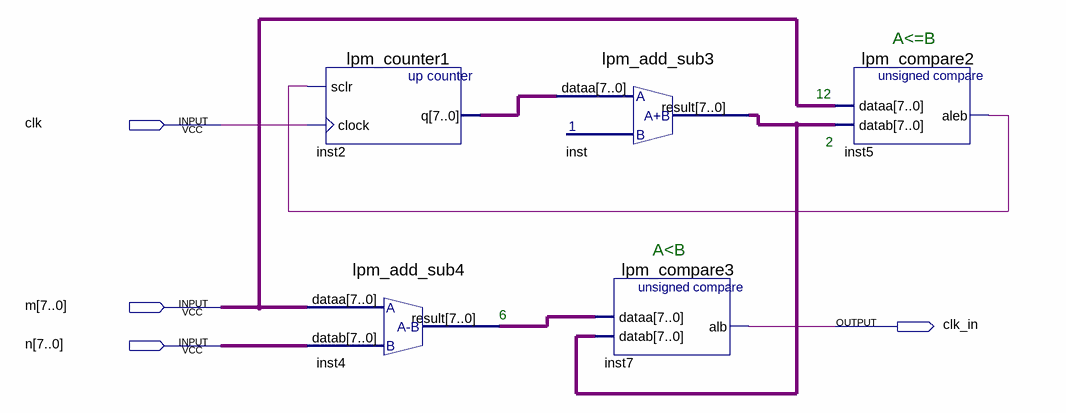
[diagram p0: schematic sheet]
// Quartus schematic Block1.bdf as structural Verilog: 5 symbols, 4 pins
module Block1 (
  input  clk,
  input  [7:0] m,
  input  [7:0] n,
  output clk_in
);

  wire inst5_aleb;
  wire [7:0] inst2_q, inst4_result, inst_result;

  lpm_counter1 inst2 (.sclr(inst5_aleb), .clock(clk), .q(inst2_q));
  lpm_add_sub4 inst4 (.dataa(m), .datab(n), .result(inst4_result));
  lpm_add_sub3 inst (.dataa(inst2_q), .result(inst_result));
  lpm_compare3 inst7 (.dataa(inst4_result), .datab(inst_result), .alb(clk_in));
  lpm_compare2 inst5 (.dataa(m), .datab(inst_result), .aleb(inst5_aleb));

  // Notes on the sheet:
  //   A<=B
  //   12
  //   2
  //   A<B
  //   6
endmodule
